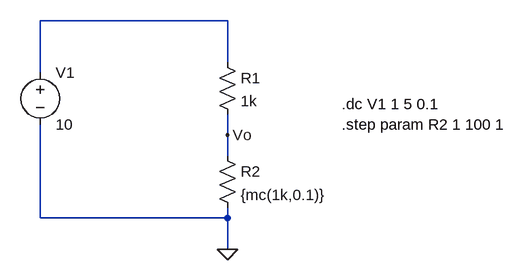
[diagram p0: schematic MONTE CARLO OLD.asc]
MONTE CARLO OLD.asc, the LTspice schematic file:
Version 4.1
SHEET 1 880 680
WIRE 96 32 -192 32
WIRE 96 96 96 32
WIRE -192 112 -192 32
WIRE 96 208 96 176
WIRE 96 240 96 208
WIRE -192 336 -192 192
WIRE 96 336 96 320
WIRE 96 336 -192 336
WIRE 96 384 96 336
FLAG 96 384 0
FLAG 96 208 Vo
SYMBOL res 80 80 R0
SYMATTR InstName R1
SYMATTR Value 1k
SYMBOL res 80 224 R0
SYMATTR InstName R2
SYMATTR Value {mc(1k,0.1)}
SYMBOL voltage -192 96 R0
WINDOW 123 0 0 Left 0
WINDOW 39 0 0 Left 0
SYMATTR InstName V1
SYMATTR Value 10
TEXT 272 160 Left 2 !.dc V1 1 5 0.1
TEXT 272 192 Left 2 !.step param R2 1 100 1

The netlist it stands for:
* MONTE CARLO OLD.asc
R1 N001 Vo 1k
R2 Vo 0 {mc(1k,0.1)}
V1 N001 0 10
.dc V1 1 5 0.1
.step param R2 1 100 1
.backanno
.end